# Altium schematic sheet DS3231.SchDoc
size A
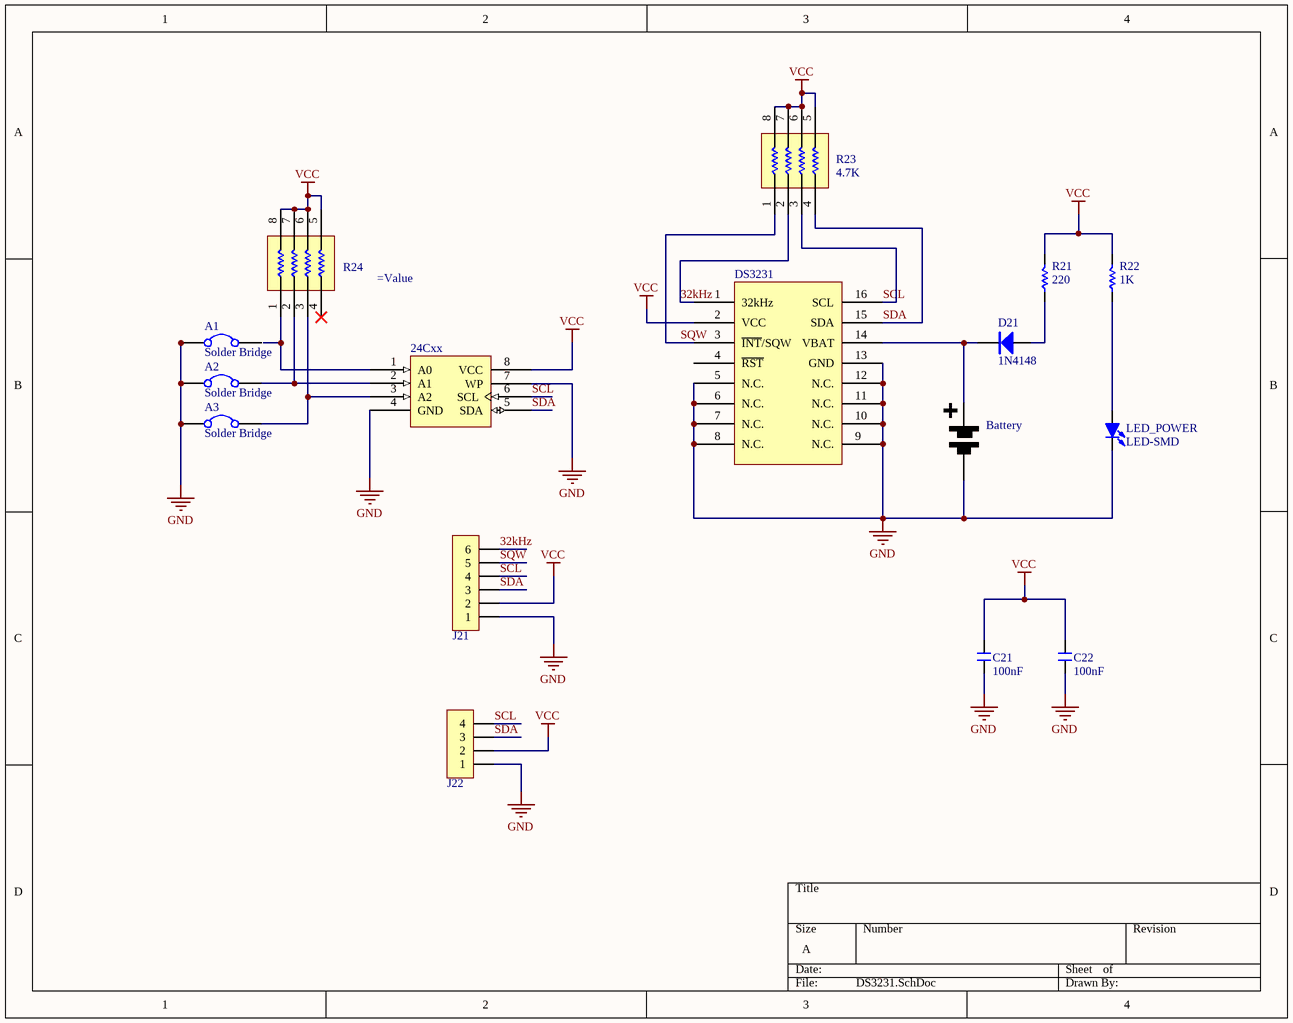
[diagram p0: DS3231.SchDoc]

## Parts
24Cxx  24Cxx  [SOP8_L]  (value not drawn)
A1  Solder Bridge  [Solder Bridge]
A2  Solder Bridge  [Solder Bridge]
A3  Solder Bridge  [Solder Bridge]
Battery  Battery Button Cell  [CR2032]  (value not drawn)
C21  100nF  [C 0805]
C22  100nF  [C 0805]
D21  1N4148  [MINI_MELF (LL34)]
DS3231  DS3231  [SOP16W_L]  (value not drawn)
J21  HDR-1X6  [HDR-1X6]  (value not drawn)
J22  HDR-1X4  [HDR-1X4]  (value not drawn)
LED_POWER  LED-SMD  [LED 0805R]
R21  220  [R 0805]
R22  1K  [R 0805]
R23  4.7K  [RA1206 (4x0603)]
R24  (no value)  [RA1206 (4x0603)]

## Nets
GND: 24Cxx.4(GND) 24Cxx.7(WP) A1.1 A2.1 A3.1 Battery.2(-) C21.2 C22.1 DS3231.5(N.C.) DS3231.6(N.C.) DS3231.7(N.C.) DS3231.8(N.C.) DS3231.9(N.C.) DS3231.10(N.C.) DS3231.11(N.C.) DS3231.12(N.C.) DS3231.13(GND) J21.1 J22.1 LED_POWER.2(K)
VCC: 24Cxx.8(VCC) C21.1 C22.2 DS3231.2(VCC) J21.2 J22.2 R21.2 R22.2 R23.5 R23.6 R23.7 R23.8 R24.5 R24.6 R24.7 R24.8
32kHz: DS3231.1(32kHz) J21.6 R23.2
SCL: 24Cxx.6(SCL) DS3231.16(SCL) J21.4 J22.4 R23.3
SDA: 24Cxx.5(SDA) DS3231.15(SDA) J21.3 J22.3 R23.4
SQW: DS3231.3(~{INT}/SQW) J21.5 R23.1
Net24Cxx_1: 24Cxx.1(A0) R24.1
Net24Cxx_2: 24Cxx.2(A1) A2.2 R24.2
Net24Cxx_3: 24Cxx.3(A2) A3.2 R24.3
NetBattery_1: Battery.1(+) D21.2(K) DS3231.14(VBAT)
NetD21_1: D21.1(A) R21.1
NetLED_POWER_1: LED_POWER.1(A) R22.1

Not connected (* = marked no-connect by the designer): A1 2; DS3231 4(~{RST}); R24 4*

## Library data of the parts
24Cxx = 24Cxx: Two-wire Serial EEPROM; BOM名称: 外置EEPROM; 版权归属: 源创客; 学习资源: www.ooocke.com
Battery = Battery Button Cell: Mini Battery
C21 C22 = C: Non-polar patch capacitor; BOM名称: 无极性贴片电容; 版权归属: 源创客; 学习资源: www.ooocke.com
D21 = 1N4148: High speed switching diode; BOM名称: 高速开关二极管; 版权归属: 源创客; 学习资源: www.ooocke.com
DS3231 = DS3231: Real time clock chip
J21 = Header 6: 6P接插件; 版权归属: 源创客; BOM名称: 6P接插件; 学习资源: www.ooocke.com
J22 = Header 4: 4P connector; BOM名称: 4P接插件; 版权归属: 源创客; 学习资源: www.ooocke.com
LED_POWER = LED-SMD: Patch LED; BOM名称: 贴片LED; 版权归属: 源创客; 学习资源: www.ooocke.com
R21 R22 = R: Chip resistor; 版权归属: 源创客; BOM名称: Chip resistor; 学习资源: www.ooocke.com
R23 R24 = R-ARR: 4 way Chip Resistor Array